# EAGLE design antares-I (EAGLE 4.16)
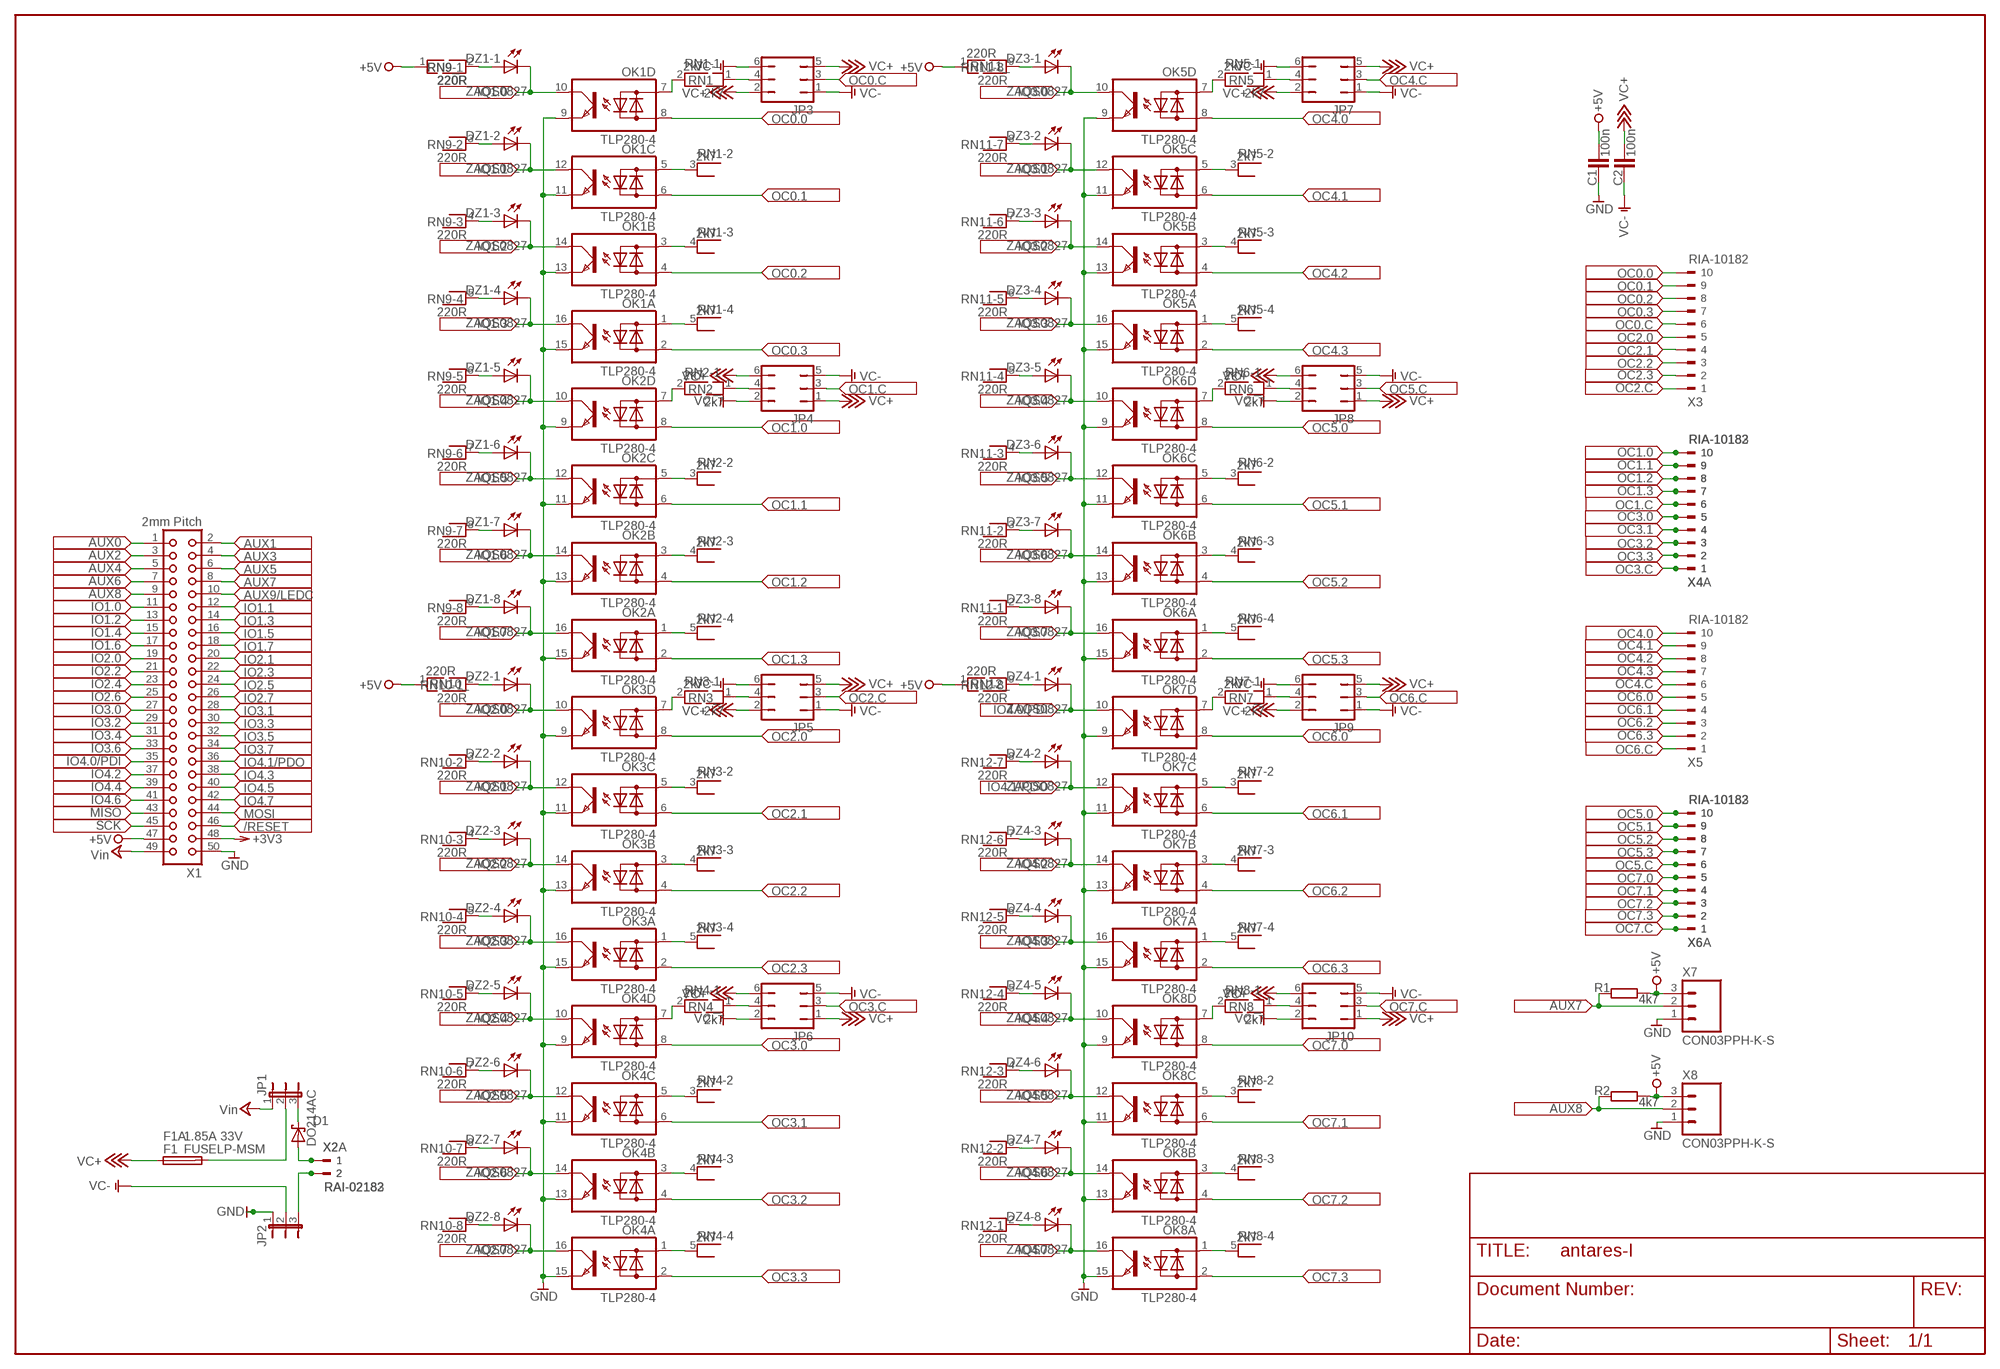
[diagram p0: schematic, sheet 1]

## Parts
C1  100n  C-EUC1206  [C1206]
C2  100n  C-EUC1206  [C1206]
D1  DO214AC  SCHOTTKY-DIODESMA  [SMA]
DZ1  ZAQS0827  [ZAQS0827]
DZ2  ZAQS0827  [ZAQS0827]
DZ3  ZAQS0827  [ZAQS0827]
DZ4  ZAQS0827  [ZAQS0827]
F1  FUSELP-MSM  [LP-MSM]
F1A  1.85A 33V  FUSEPOLY  [POLYFUSE]
JP1  JP2EI  [JP2]
JP2  JP2EI  [JP2]
JP3  JP3Q  [JP3Q]
JP4  JP3Q  [JP3Q]
JP5  JP3Q  [JP3Q]
JP6  JP3Q  [JP3Q]
JP7  JP3Q  [JP3Q]
JP8  JP3Q  [JP3Q]
JP9  JP3Q  [JP3Q]
JP10  JP3Q  [JP3Q]
OK1  TLP280-4  [MINI-FLAT-16]
OK2  TLP280-4  [MINI-FLAT-16]
OK3  TLP280-4  [MINI-FLAT-16]
OK4  TLP280-4  [MINI-FLAT-16]
OK5  TLP280-4  [MINI-FLAT-16]
OK6  TLP280-4  [MINI-FLAT-16]
OK7  TLP280-4  [MINI-FLAT-16]
OK8  TLP280-4  [MINI-FLAT-16]
R1  4k7  R-EU_R0603  [R0603]
R2  4k7  R-EU_R0603  [R0603]
RN1  2k7  RNX4  [RN-5]
RN2  2k7  RNX4  [RN-5]
RN3  2k7  RNX4  [RN-5]
RN4  2k7  RNX4  [RN-5]
RN5  2k7  RNX4  [RN-5]
RN6  2k7  RNX4  [RN-5]
RN7  2k7  RNX4  [RN-5]
RN8  2k7  RNX4  [RN-5]
RN9  220R  RNX8  [RN-9]
RN10  220R  RNX8  [RN-9]
RN11  220R  RNX8  [RN-9]
RN12  220R  RNX8  [RN-9]
X1  2mm Pitch  CON50M  [2MM-50DM]
X2  RAI-02183  [183-02]
X2A  RAI-02182  [182-02]
X3  RIA-10182  [182-10]
X4  RIA-10183  [183-10]
X4A  RIA-10182  [182-10]
X5  RIA-10182  [182-10]
X6  RIA-10183  [183-10]
X6A  RIA-10182  [182-10]
X7  CON03PPH-K-S  [B3B-PH-K-S]
X8  CON03PPH-K-S  [B3B-PH-K-S]

## Nets
+3V3: X1.48
+5V: C1.2 R1.2 R2.2 RN9.1 RN10.1 RN11.1 RN12.1 X1.47 X7.3 X8.3
/RESET: X1.46
AUX0: X1.1
AUX1: X1.2
AUX2: X1.3
AUX3: X1.4
AUX4: X1.5
AUX5: X1.6
AUX6: X1.7
AUX7: R1.1 X1.8 X7.2
AUX8: R2.1 X1.9 X8.2
AUX9: X1.10
GND [gnd-vcc]: C1.1 JP2.1 OK1.9(D:E) OK1.11(C:E) OK1.13(B:E) OK1.15(A:E) OK2.9(D:E) OK2.11(C:E) OK2.13(B:E) OK2.15(A:E) OK3.9(D:E) OK3.11(C:E) OK3.13(B:E) OK3.15(A:E) OK4.9(D:E) OK4.11(C:E) OK4.13(B:E) OK4.15(A:E) OK5.9(D:E) OK5.11(C:E) OK5.13(B:E) OK5.15(A:E) OK6.9(D:E) OK6.11(C:E) OK6.13(B:E) OK6.15(A:E) OK7.9(D:E) OK7.11(C:E) OK7.13(B:E) OK7.15(A:E) OK8.9(D:E) OK8.11(C:E) OK8.13(B:E) OK8.15(A:E) X1.50 X7.1 X8.1
IO1.0: DZ1.K1(-1:C) OK1.10(D:C) X1.11
IO1.1: DZ1.K2(-2:C) OK1.12(C:C) X1.12
IO1.2: DZ1.K3(-3:C) OK1.14(B:C) X1.13
IO1.3: DZ1.K4(-4:C) OK1.16(A:C) X1.14
IO1.4: DZ1.K5(-5:C) OK2.10(D:C) X1.15
IO1.5: DZ1.K6(-6:C) OK2.12(C:C) X1.16
IO1.6: DZ1.K7(-7:C) OK2.14(B:C) X1.17
IO1.7: DZ1.K8(-8:C) OK2.16(A:C) X1.18
IO2.0: DZ2.K1(-1:C) OK3.10(D:C) X1.19
IO2.1: DZ2.K2(-2:C) OK3.12(C:C) X1.20
IO2.2: DZ2.K3(-3:C) OK3.14(B:C) X1.21
IO2.3: DZ2.K4(-4:C) OK3.16(A:C) X1.22
IO2.4: DZ2.K5(-5:C) OK4.10(D:C) X1.23
IO2.5: DZ2.K6(-6:C) OK4.12(C:C) X1.24
IO2.6: DZ2.K7(-7:C) OK4.14(B:C) X1.25
IO2.7: DZ2.K8(-8:C) OK4.16(A:C) X1.26
IO3.0: DZ3.K1(-1:C) OK5.10(D:C) X1.27
IO3.1: DZ3.K2(-2:C) OK5.12(C:C) X1.28
IO3.2: DZ3.K3(-3:C) OK5.14(B:C) X1.29
IO3.3: DZ3.K4(-4:C) OK5.16(A:C) X1.30
IO3.4: DZ3.K5(-5:C) OK6.10(D:C) X1.31
IO3.5: DZ3.K6(-6:C) OK6.12(C:C) X1.32
IO3.6: DZ3.K7(-7:C) OK6.14(B:C) X1.33
IO3.7: DZ3.K8(-8:C) OK6.16(A:C) X1.34
IO4.0: DZ4.K1(-1:C) OK7.10(D:C) X1.35
IO4.1: DZ4.K2(-2:C) OK7.12(C:C) X1.36
IO4.2: DZ4.K3(-3:C) OK7.14(B:C) X1.37
IO4.3: DZ4.K4(-4:C) OK7.16(A:C) X1.38
IO4.4: DZ4.K5(-5:C) OK8.10(D:C) X1.39
IO4.5: DZ4.K6(-6:C) OK8.12(C:C) X1.40
IO4.6: DZ4.K7(-7:C) OK8.14(B:C) X1.41
IO4.7: DZ4.K8(-8:C) OK8.16(A:C) X1.42
MISO: X1.43
MOSI: X1.44
N$1 [power]: D1.A X2.1 X2A.1
N$2: D1.C JP1.3
N$3: OK2.7(D:AC1) RN2.2
N$4: OK5.7(D:AC1) RN5.2
N$5: OK5.5(C:AC1) RN5.3
N$6: OK2.5(C:AC1) RN2.3
N$7: OK1.7(D:AC1) RN1.2
N$8: OK2.1(A:AC1) RN2.5
N$9: OK2.3(B:AC1) RN2.4
N$10: OK3.7(D:AC1) RN3.2
N$11: OK3.5(C:AC1) RN3.3
N$12: OK3.3(B:AC1) RN3.4
N$13: OK3.1(A:AC1) RN3.5
N$14: OK4.7(D:AC1) RN4.2
N$15: OK4.5(C:AC1) RN4.3
N$16: OK4.3(B:AC1) RN4.4
N$17: OK4.1(A:AC1) RN4.5
N$18: OK5.3(B:AC1) RN5.4
N$19: OK5.1(A:AC1) RN5.5
N$20: OK6.7(D:AC1) RN6.2
N$21: OK6.5(C:AC1) RN6.3
N$22: OK6.3(B:AC1) RN6.4
N$23: OK6.1(A:AC1) RN6.5
N$24: OK7.7(D:AC1) RN7.2
N$25: OK7.5(C:AC1) RN7.3
N$26: OK7.3(B:AC1) RN7.4
N$27: OK7.1(A:AC1) RN7.5
N$28: OK8.7(D:AC1) RN8.2
N$29: OK8.5(C:AC1) RN8.3
N$30: OK8.3(B:AC1) RN8.4
N$31: OK8.1(A:AC1) RN8.5
N$32: JP3.4 RN1.1
N$33: JP4.4 RN2.1
N$34: JP5.4 RN3.1
N$35: JP6.4 RN4.1
N$36: JP7.4 RN5.1
N$37: JP10.4 RN8.1
N$38: JP9.4 RN7.1
N$39: JP8.4 RN6.1
N$40: JP2.3 X2.2 X2A.2
N$43: DZ1.A1(-1:A) RN9.2
N$44: DZ1.A2(-2:A) RN9.3
N$45: DZ1.A3(-3:A) RN9.4
N$46: DZ1.A4(-4:A) RN9.5
N$47: DZ1.A5(-5:A) RN9.6
N$48: DZ1.A6(-6:A) RN9.7
N$49: DZ1.A7(-7:A) RN9.8
N$50: DZ1.A8(-8:A) RN9.9
N$51: DZ2.A1(-1:A) RN10.2
N$52: DZ2.A2(-2:A) RN10.3
N$53: DZ2.A3(-3:A) RN10.4
N$54: DZ2.A4(-4:A) RN10.5
N$55: DZ2.A5(-5:A) RN10.6
N$56: DZ2.A6(-6:A) RN10.7
N$57: DZ2.A8(-8:A) RN10.9
N$58: DZ2.A7(-7:A) RN10.8
N$59: DZ3.A1(-1:A) RN11.9
N$60: DZ3.A2(-2:A) RN11.8
N$61: DZ3.A3(-3:A) RN11.7
N$62: DZ3.A4(-4:A) RN11.6
N$63: DZ3.A5(-5:A) RN11.5
N$64: DZ3.A6(-6:A) RN11.4
N$65: DZ3.A7(-7:A) RN11.3
N$66: DZ3.A8(-8:A) RN11.2
N$67: DZ4.A1(-1:A) RN12.9
N$68: DZ4.A2(-2:A) RN12.8
N$69: DZ4.A3(-3:A) RN12.7
N$70: DZ4.A4(-4:A) RN12.6
N$71: DZ4.A5(-5:A) RN12.5
N$72: DZ4.A6(-6:A) RN12.4
N$73: DZ4.A7(-7:A) RN12.3
N$74: DZ4.A8(-8:A) RN12.2
N$75: OK1.5(C:AC1) RN1.3
N$76: OK1.3(B:AC1) RN1.4
N$77: OK1.1(A:AC1) RN1.5
OC0.0: OK1.8(D:AC2) X3.10
OC0.1: OK1.6(C:AC2) X3.9
OC0.2: OK1.4(B:AC2) X3.8
OC0.3: OK1.2(A:AC2) X3.7
OC0.C: JP3.3 X3.6
OC1.0: OK2.8(D:AC2) X4.10 X4A.10
OC1.1: OK2.6(C:AC2) X4.9 X4A.9
OC1.2: OK2.4(B:AC2) X4.8 X4A.8
OC1.3: OK2.2(A:AC2) X4.7 X4A.7
OC1.C: JP4.3 X4.6 X4A.6
OC2.0: OK3.8(D:AC2) X3.5
OC2.1: OK3.6(C:AC2) X3.4
OC2.2: OK3.4(B:AC2) X3.3
OC2.3: OK3.2(A:AC2) X3.2
OC2.C: JP5.3 X3.1
OC3.0: OK4.8(D:AC2) X4.5 X4A.5
OC3.1: OK4.6(C:AC2) X4.4 X4A.4
OC3.2: OK4.4(B:AC2) X4.3 X4A.3
OC3.3: OK4.2(A:AC2) X4.2 X4A.2
OC3.C: JP6.3 X4.1 X4A.1
OC4.0: OK5.8(D:AC2) X5.10
OC4.1: OK5.6(C:AC2) X5.9
OC4.2: OK5.4(B:AC2) X5.8
OC4.3: OK5.2(A:AC2) X5.7
OC4.C: JP7.3 X5.6
OC5.0: OK6.8(D:AC2) X6.10 X6A.10
OC5.1: OK6.6(C:AC2) X6.9 X6A.9
OC5.2: OK6.4(B:AC2) X6.8 X6A.8
OC5.3: OK6.2(A:AC2) X6.7 X6A.7
OC5.C: JP8.3 X6.6 X6A.6
OC6.0: OK7.8(D:AC2) X5.5
OC6.1: OK7.6(C:AC2) X5.4
OC6.2: OK7.4(B:AC2) X5.3
OC6.3: OK7.2(A:AC2) X5.2
OC6.C: JP9.3 X5.1
OC7.0: OK8.8(D:AC2) X6.5 X6A.5
OC7.1: OK8.6(C:AC2) X6.4 X6A.4
OC7.2: OK8.4(B:AC2) X6.3 X6A.3
OC7.3: OK8.2(A:AC2) X6.2 X6A.2
OC7.C: JP10.3 X6.1 X6A.1
SCK: X1.45
VC+ [gnd-vcc]: C2.2 F1.1 F1A.1 JP3.2 JP3.5 JP4.1 JP4.6 JP5.2 JP5.5 JP6.1 JP6.6 JP7.2 JP7.5 JP8.1 JP8.6 JP9.2 JP9.5 JP10.1 JP10.6
VC- [gnd-vcc]: C2.1 JP2.2 JP3.1 JP3.6 JP4.2 JP4.5 JP5.1 JP5.6 JP6.2 JP6.5 JP7.1 JP7.6 JP8.2 JP8.5 JP9.1 JP9.6 JP10.2 JP10.5
VIN [power]: JP1.1 X1.49 ; supply symbol labelled Vin
VSUPP [power]: F1.2 F1A.2 JP1.2

## Library data of the parts
C1 C2 = rcl:C-EU: CAPACITOR, European symbol
D1 = diode:SCHOTTKY-DIODE: Schottky Diode
DZ1-DZ4 = led:ZAQS0827: LED BLOCK 9 LEDs, Siemens
F1 F1A = fuse:FUSE: Fuse
JP1 JP2 = jumper:JP2E: JUMPER
JP3-JP10 = jumper:JP3Q: JUMPER
OK1-OK8 = optocoupler:TLP280-4: TEXAS INSTRUMENTS OPTO COUPLER
R1 R2 = rcl:R-EU_: RESISTOR, European symbol
RN1-RN8 = resistor-net:RNX4: RESISTOR NETWORK
RN9-RN12 = resistor-net:RNX8: RESISTOR NETWORK
X1 = con-2mm-dual:CON50: CONNECTOR
X2 X2A = con-ria:RAI-02
X3 X4 X4A X5 X6 X6A = con-ria:RIA-10
X7 X8 = _frank:CON03P

## Net classes
0 default: width 0.15 mm, drill 0.15 mm, clearance 0.3 mm
1 power: width 0.15 mm, drill 0.3 mm, clearance 0.3 mm
2 gnd-vcc: width 0.3 mm, drill 0.15 mm, clearance 0.3 mm

## Board
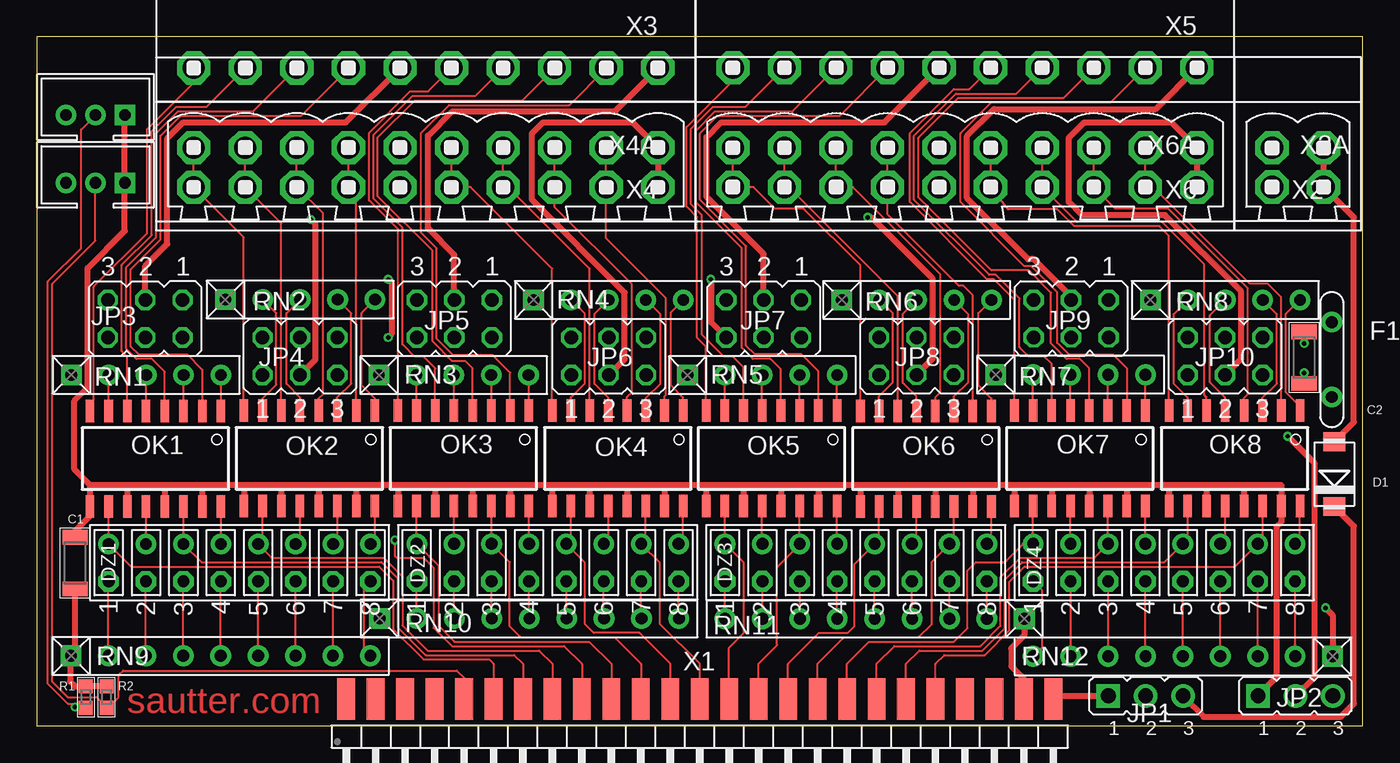
[diagram p1: board, top side]
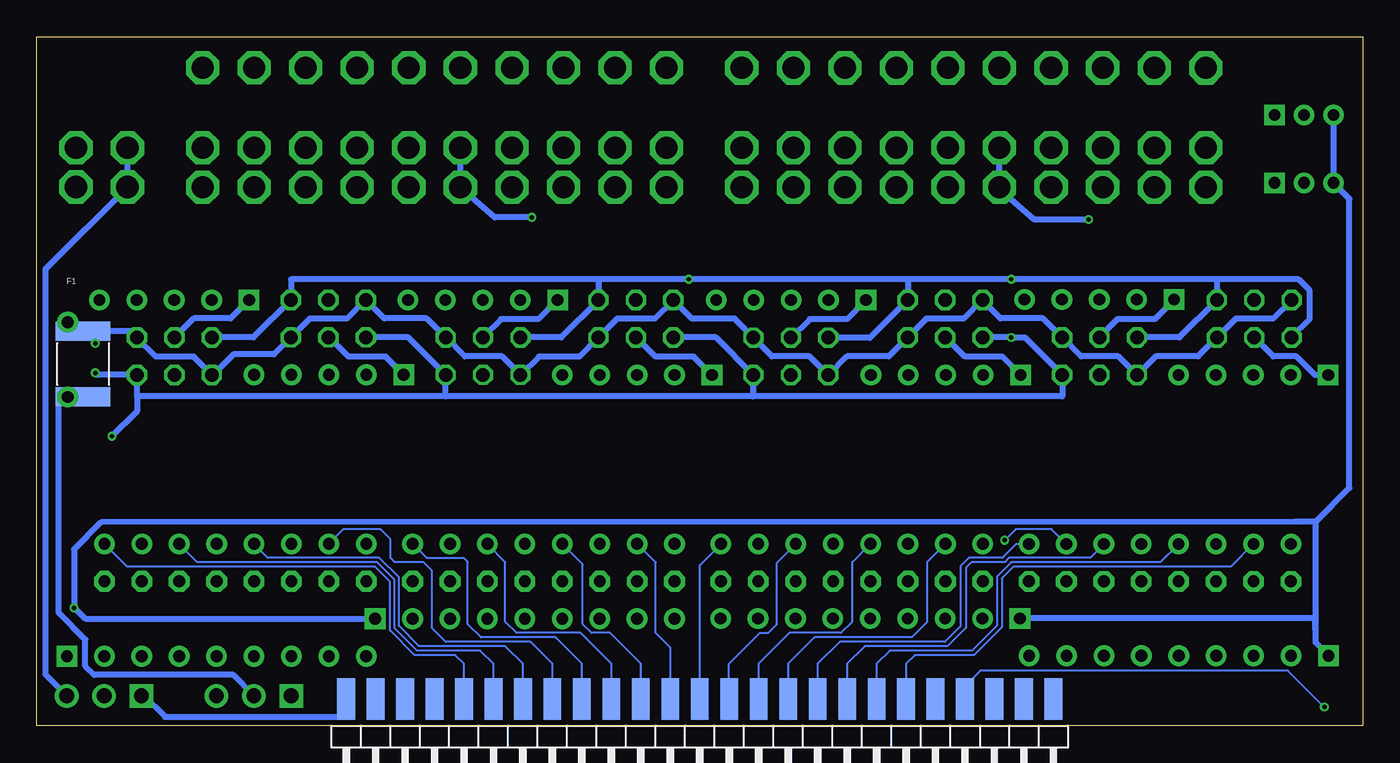
[diagram p2: board, bottom side, seen from below]

Size 90 x 46.75 mm. Coordinates in mm from the lower left corner, seen from the top.
Outline: 90,0 90,46.75 0,46.75 0,0 90,0
Copper layers (1*16): Top 0.035mm / dielectric 1.5mm / Bottom 0.035mm
Design rules "default": minimum track width 0.15mm, minimum drill 0.3mm, track to track 0.15mm, track to pad 0.15mm, pad to pad 0.15mm, via to via 0.15mm, smd to smd 0mil, copper to edge 0.35mm, drill to drill 8mil, minimum pad ring 0.15mm, minimum via ring 0.15mm, stop-mask expansion 0.15mm, vias tented up to drill 0.35mm, thermal gap 10mil

### Footprints (pad centres in the part's own frame; a part is rotated, then mirrored left to right if it is on the bottom)
C1206 = smd 1 x 1.7: 1 -1.75,0; 2 1.75,0
SMA = smd 1.27 x 1.473: A 2.2,0; C -2.2,0
ZAQS0827 = drill 0.8 pad 1.4 octagon: A1 -1.27,8.89; A2 -1.27,6.35; A3 -1.27,3.81; A4 -1.27,1.27; A5 -1.27,-1.27; A6 -1.27,-3.81; A7 -1.27,-6.35; A8 -1.27,-8.89 | drill 0.8 pad 1.4 round: K1 1.27,8.89; K2 1.27,6.35; K3 1.27,3.81; K4 1.27,1.27; K5 1.27,-1.27; K6 1.27,-3.81; K7 1.27,-6.35; K8 1.27,-8.89
LP-MSM = smd 1.27 x 3.683: 1 -2.222,0; 2 2.223,0
POLYFUSE = drill 0.8 pad 1.4 round: 1 -2.54,0; 2 2.54,0
JP2 = drill 1 pad 1.6 square: 1 -2.54,0 | drill 1 pad 1.6 round: 2 0,0; 3 2.54,0
JP3Q = drill 0.914 octagon: 1 -2.54,-1.27; 2 -2.54,1.27; 3 0,-1.27; 4 0,1.27; 5 2.54,-1.27; 6 2.54,1.27
MINI-FLAT-16 = smd 1.524 x 0.584: 1 -3.24,4.445; 2 -3.24,3.175; 3 -3.24,1.905; 4 -3.24,0.635; 5 -3.24,-0.635; 6 -3.24,-1.905; 7 -3.24,-3.175; 8 -3.24,-4.445; 9 3.24,-4.445; 10 3.24,-3.175; 11 3.24,-1.905; 12 3.24,-0.635; 13 3.24,0.635; 14 3.24,1.905; 15 3.24,3.175; 16 3.24,4.445
R0603 = smd 0.95 x 0.95: 1 -0.725,0; 2 0.725,0
RN-5 = drill 0.8 pad 1.4 square: 1 -5.08,0 | drill 0.8 pad 1.4 round: 2 -2.54,0; 3 0,0; 4 2.54,0; 5 5.08,0
RN-9 = drill 0.8 pad 1.4 square: 1 -10.16,0 | drill 0.8 pad 1.4 round: 2 -7.62,0; 3 -5.08,0; 4 -2.54,0; 5 0,0; 6 2.54,0; 7 5.08,0; 8 7.62,0; 9 10.16,0
2MM-50DM = smd 2.8 x 1.2: 1 3.3,24; 3 3.3,22; 5 3.3,20; 7 3.3,18; 9 3.3,16; 11 3.3,14; 13 3.3,12; 15 3.3,10; 17 3.3,8; 19 3.3,6; 21 3.3,4; 23 3.3,2; 25 3.3,0; 27 3.3,-2; 29 3.3,-4; 31 3.3,-6; 33 3.3,-8; 35 3.3,-10; 37 3.3,-12; 39 3.3,-14; 41 3.3,-16; 43 3.3,-18; 45 3.3,-20; 47 3.3,-22; 49 3.3,-24 | smd 2.8 x 1.2 bottom: 2 3.3,24; 4 3.3,22; 6 3.3,20; 8 3.3,18; 10 3.3,16; 12 3.3,14; 14 3.3,12; 16 3.3,10; 18 3.3,8; 20 3.3,6; 22 3.3,4; 24 3.3,2; 26 3.3,0; 28 3.3,-2; 30 3.3,-4; 32 3.3,-6; 34 3.3,-8; 36 3.3,-10; 38 3.3,-12; 40 3.3,-14; 42 3.3,-16; 44 3.3,-18; 46 3.3,-20; 48 3.3,-22; 50 3.3,-24
183-02 = drill 1.5 pad 2 octagon: 1 -1.75,0; 2 1.75,0
182-02 = drill 1.5 pad 2 octagon: 1 -1.75,0; 2 1.75,0
182-10 = drill 1.5 pad 2 octagon: 1 -15.75,0; 2 -12.25,0; 3 -8.75,0; 4 -5.25,0; 5 -1.75,0; 6 1.75,0; 7 5.25,0; 8 8.75,0; 9 12.25,0; 10 15.75,0
183-10 = drill 1.5 pad 2 octagon: 1 -15.75,0; 2 -12.25,0; 3 -8.75,0; 4 -5.25,0; 5 -1.75,0; 6 1.75,0; 7 5.25,0; 8 8.75,0; 9 12.25,0; 10 15.75,0
B3B-PH-K-S = drill 0.8 pad 1.4 square: 1 0,-2 | drill 0.8 pad 1.4 round: 2 0,0; 3 0,2

### Placement (x,y rotation side)
C1  2.6,11.04 270 top
C2  86.02,24.98 90 top
D1  88.08,17.08 90 top
DZ1  13.76,11.07 90 top
DZ2  34.67,11.07 90 top
DZ3  55.6,11.07 90 top
DZ4  76.53,11.07 90 top
F1  86.86,24.55 270 bottom
F1A  87.91,24.85 270 top
JP1  75.27,2.04 0 top
JP2  85.43,2.04 0 top
JP3  7.36,27.62 180 top
JP4  17.86,25.08 0 top
JP5  28.34,27.62 180 top
JP6  38.81,25.07 0 top
JP7  49.34,27.62 180 top
JP8  59.71,25.09 0 top
JP9  70.21,27.63 180 top
JP10  80.67,25.07 0 top
OK1  8.05,18.14 270 top
OK2  18.5,18.14 270 top
OK3  28.95,18.14 270 top
OK4  39.43,18.15 270 top
OK5  49.88,18.15 270 top
OK6  60.35,18.12 270 top
OK7  70.8,18.15 270 top
OK8  81.3,18.15 270 top
R1  3.33,1.95 90 top
R2  4.73,1.95 90 top
RN1  7.42,23.81 0 top
RN2  17.88,28.93 0 top
RN3  28.3,23.8 0 top
RN4  38.8,28.9 0 top
RN5  49.25,23.8 0 top
RN6  59.73,28.9 0 top
RN7  70.17,23.82 0 top
RN8  80.67,28.9 0 top
RN9  12.48,4.75 0 top
RN10  33.42,7.29 0 top
RN11  56.88,7.26 180 top
RN12  77.8,4.71 180 top
X1  45,-1.49 90 top
X2  85.59,39.22 180 top
X2A  85.59,36.56 180 top
X3  26.4,44.64 180 top
X4  26.4,39.23 180 top
X4A  26.4,36.54 180 top
X5  63,44.65 180 top
X6  63,39.23 180 top
X6A  63,36.55 180 top
X7  3.98,41.44 90 top
X8  3.98,36.84 90 top

### Tracks (layer width: path | path; a pad name or v marks a point on that pad's centre or on a via)
+5V  (via drill 0.3 pad 0.6)
  Top 0.4: X1.47 67,3.2 66.15,4.05 66.15,5.25 67.05,6.15 67.05,7.2 67.03,7.21 RN11.1 | RN12.1 87.96,7.51 v87.47,8 | C1.2 2.6,5.08 2.3,4.78 RN9.1 | 3.31,2.7 3.3,2.7 | 3.31,2.7 R1.2 2.59,2.68 2.25,3 2.25,4.75 RN9.1 | R2.2 4.71,2.7 3.31,2.7 | RN9.1
  Bottom 0.4: RN9.1 3.2,5.65 | 3.2,13.85 4.6,13.85 85.65,13.8 87.47,11.97 v87.47,8 86.71,7.26 RN11.1 | 3.2,5.65 3.2,13.85 | RN10.1 3.21,7.29 3.2,5.65 | X7.3 X8.3 0.9,35.76 0.9,16.15 3.2,13.85
AUX7  (via drill 0.3 pad 0.6)
  Top 0.15: X7.2 3,40.46 3,32.4 0.75,30.15 0.75,2.85 2.1,1.5 2.83,1.5 | R1.1 3.3,1.25 3.3,1.5 2.83,1.5 | 2.83,1.5 v2.6,1.27
  Bottom 0.15: X1.8 27,2.7 25.95,3.75 5.08,3.75 v2.6,1.27
AUX8
  Top 0.15: X8.2 3.98,32.93 1.05,30 1.05,3 2.1,1.95 4.05,1.95 4.65,1.35 4.65,1.3 R2.1 4.83,1.23 5.55,1.95 5.55,3.45 5.85,3.75 28.5,3.75 29,3.25 X1.9
GND
  Top 0.4: 3.61,16.35 OK1.9 3.61,14.26 2.59,13.24 C1.1 | 3.61,16.35 6.15,16.35 | 6.15,16.35 8.7,16.35 | 8.7,16.35 11.22,16.35 | 11.22,16.35 14.05,16.35 | 14.05,16.35 16.6,16.35 | 16.6,16.35 19.12,16.35 | 19.12,16.35 21.68,16.35 | 21.68,16.35 24.52,16.35 | 24.52,16.35 27.05,16.35 | 27.05,16.35 29.6,16.35 | 29.6,16.35 32.12,16.35 | 32.12,16.35 34.98,16.35 | 34.98,16.35 37.52,16.35 | 37.52,16.35 40.08,16.35 | 40.08,16.35 42.6,16.35 | 42.6,16.35 45.42,16.35 | 45.42,16.35 47.98,16.35 | 47.98,16.35 50.5,16.35 | 50.5,16.35 53.05,16.35 | 53.05,16.35 55.9,16.35 | 55.9,16.35 58.45,16.35 | 58.45,16.35 60.98,16.35 | 60.98,16.35 63.52,16.35 | 63.52,16.35 66.35,16.35 | 66.35,16.35 68.9,16.35 | 68.9,16.35 71.45,16.35 | 71.45,16.35 73.97,16.35 | 73.97,16.35 76.85,16.35 | 76.85,16.35 79.4,16.35 | 79.4,16.35 81.92,16.35 | OK8.13 81.94,16.05 81.92,16.35 | OK8.11 79.39,16.05 79.4,16.35 | OK8.9 76.86,16.05 76.85,16.35 | 73.97,16.35 OK7.15 | OK7.13 71.44,16.05 71.45,16.35 | OK7.11 68.89,16.05 68.9,16.35 | OK7.9 66.36,16.05 66.35,16.35 | 63.52,16.35 OK6.15 | OK6.13 60.98,16.05 60.98,16.35 | OK6.11 58.45,16.05 58.45,16.35 | OK6.9 55.91,16.05 55.9,16.35 | 53.05,16.35 OK5.15 | OK5.13 50.51,16.05 50.5,16.35 | OK5.11 47.97,16.05 47.98,16.35 | OK5.9 45.43,16.05 45.42,16.35 | OK4.15 42.6,16.05 42.6,16.35 | OK4.13 40.06,16.05 40.08,16.35 | 37.52,16.35 OK4.11 | OK4.9 34.98,16.05 34.98,16.35 | OK3.15 32.13,16.05 32.12,16.35 | OK3.13 29.59,16.05 29.6,16.35 | 27.05,16.35 OK3.11 | OK3.9 24.51,16.05 24.52,16.35 | OK2.15 21.68,16.05 21.68,16.35 | OK2.13 19.14,16.05 19.12,16.35 | 16.6,16.35 OK2.11 | OK2.9 14.06,16.05 14.05,16.35 | OK1.15 11.23,16.05 11.22,16.35 | OK1.13 8.69,16.05 8.7,16.35 | 6.15,16.35 OK1.11
  Top 0.4: 81.92,16.35 84.47,16.35 OK8.15 84.47,13.82 84.15,13.5 84.15,3.29 JP2.1 | X7.1 5.98,36.85 X8.1 5.98,33.58 3.45,31.05 3.45,22.95 2.55,22.05 2.55,17.4 3.6,16.35 3.61,16.35
  Bottom 0.4: X1.50 69,0.6 81.3,0.6 82.8,2.1 82.83,2.1 JP2.1
IO1.0
  Top 0.15: OK1.10 4.88,12.36 DZ1.K1 6.4,10.8 23.25,10.8 24.2,9.85 24.2,6.55 26.25,4.5 30.7,4.5 31,4.2 X1.11
IO1.1
  Top 0.15: DZ1.K2 7.42,12.35 7.42,12.36 OK1.12
  Bottom 0.15: X1.12 31,4.2 30.4,4.8 26.4,4.8 24.5,6.7 24.5,10 23.7,10.8 8.95,10.8 DZ1.K2
IO1.2
  Top 0.15: OK1.14 9.96,12.36 DZ1.K3 9.95,12.32 11.18,11.1 23.4,11.1 24.5,10 24.5,6.7 26.4,4.8 32.4,4.8 33,4.2 X1.13
IO1.3
  Top 0.15: DZ1.K4 OK1.16
  Bottom 0.15: X1.14 33,4.2 32.1,5.1 26.52,5.1 24.82,6.8 24.82,10.12 23.85,11.1 13.72,11.1 DZ1.K4
IO1.4
  Top 0.15: OK2.10 15.33,12.63 DZ1.K5 15.03,12.32 15.95,11.4 23.55,11.4 24.82,10.12 24.82,6.8 26.52,5.1 34.1,5.1 35,4.2 X1.15
IO1.5
  Top 0.15: DZ1.K6 17.87,12.64 OK2.12
  Bottom 0.15: X1.16 35,4.2 33.8,5.4 28.18,5.4 26.93,6.65 26.93,10.72 26.55,11.1 24.3,11.1 24,11.4 18.5,11.4 17.57,12.32 DZ1.K6
IO1.6  (via drill 0.3 pad 0.6)
  Top 0.15: DZ1.K7 20.41,12.63 OK2.14 | X1.17 37,4.2 35.8,5.4 28.18,5.4 26.93,6.65 26.93,10.72 26.25,11.4 24.45,11.4 24.3,11.55 v24.3,12.6
  Bottom 0.15: DZ1.K7 21.12,13.35 23.55,13.35 v24.3,12.6
IO1.7
  Top 0.15: DZ1.K8 22.95,12.65 OK2.16
  Bottom 0.15: X1.18 37,4.2 35.5,5.7 28.35,5.7 27.3,6.75 27.3,10.82 26.73,11.4 24.45,11.4 23.52,12.32 22.65,12.32 DZ1.K8
IO2.0
  Top 0.15: OK3.10 25.78,12.36 DZ2.K1 27.3,10.82 27.3,6.75 28.35,5.7 37.5,5.7 39,4.2 X1.19
IO2.1
  Top 0.15: DZ2.K2 28.32,12.36 OK3.12
  Bottom 0.15: X1.20 39,4.2 37.2,6 30.6,6 29.55,7.05 29.55,11.12 DZ2.K2
IO2.2
  Top 0.15: OK3.14 30.86,12.37 30.88,12.35 DZ2.K3 32.1,11.1 32.1,6.75 32.85,6 39.2,6 41,4.2 X1.21
IO2.3
  Top 0.15: DZ2.K4 OK3.16
  Bottom 0.15: X1.22 41,4.2 38.9,6.3 35.4,6.3 34.65,7.05 34.65,11.1 DZ2.K4
IO2.4
  Top 0.15: OK4.10 36.26,12.65 DZ2.K5 37.2,11.07 37.2,6.9 37.8,6.3 40.9,6.3 43,4.2 X1.23
IO2.5
  Top 0.15: DZ2.K6 38.49,12.35 38.8,12.64 OK4.12
  Bottom 0.15: X1.24 43,4.2 40.9,6.3 40.35,6.3 39.75,6.9 39.75,11.07 DZ2.K6
IO2.6
  Top 0.15: OK4.14 41.34,12.63 41.02,12.32 | X1.25 45,4.2 42.3,6.9 42.3,11.05 41.02,12.32 | 41.02,12.32 DZ2.K7
IO2.7
  Top 0.15: DZ2.K8 43.88,12.65 OK4.16
  Bottom 0.15: DZ2.K8 45,10.9 X1.26
IO3.0
  Top 0.15: OK5.10 46.7,12.32 DZ3.K1 48,11.05 48,6.3 47,5.3 X1.27
IO3.1
  Top 0.15: DZ3.K2 49.24,12.36 OK5.12
  Bottom 0.15: X1.28 47,5.3 48,6.3 48,11.1 DZ3.K2
IO3.2
  Top 0.15: OK5.14 51.78,12.37 DZ3.K3 51.8,12.32 50.25,10.78 50.25,5.47 49,4.22 X1.29
IO3.3
  Top 0.15: OK5.16 54.32,12.36 DZ3.K4
  Bottom 0.15: X1.30 49,4.22 51.08,6.3 52.35,6.3 52.95,6.9 52.95,10.95 DZ3.K4
IO3.4
  Top 0.15: OK6.10 57.17,12.65 DZ3.K5 56.87,12.32 55.5,10.95 55.5,6.75 55.05,6.3 53.1,6.3 51,4.2 X1.31
IO3.5
  Top 0.15: DZ3.K6 59.72,12.64 OK6.12
  Bottom 0.15: X1.32 51,4.2 53.1,6.3 57.45,6.3 58.2,7.05 58.2,11.1 59.41,12.31 DZ3.K6
IO3.6
  Top 0.15: OK6.14 62.26,12.65 DZ3.K7 61.95,12.32 60.75,11.12 60.75,6.9 59.85,6 54.8,6 53,4.2 X1.33
IO3.7
  Top 0.15: DZ3.K8 64.8,12.64 OK6.16
  Bottom 0.15: X1.34 53,4.2 54.8,6 59.85,6 60.75,6.9 60.75,11.12 61,11.38 63.52,11.38 DZ3.K8
IO4.0
  Top 0.15: OK7.10 67.62,12.35 DZ4.K1 67.62,12.35 67.6,12.32 66.92,12.32 65.7,11.1 63.75,11.1 63.17,10.53 63.17,6.62 62.25,5.7 56.5,5.7 55,4.2 X1.35
IO4.1
  Top 0.15: DZ4.K2 70.17,12.36 OK7.12
  Bottom 0.15: X1.36 55,4.2 56.5,5.7 62.25,5.7 63.17,6.62 63.17,10.53 63.75,11.1 65.7,11.1 66,11.4 66,12.65 66.67,13.32 69.2,13.32 DZ4.K2
IO4.2
  Top 0.15: OK7.14 72.7,12.37 DZ4.K3 71.78,11.4 66.75,11.4 65.42,10.07 65.42,6.78 64.05,5.4 58.2,5.4 57,4.2 X1.37
IO4.3
  Top 0.15: OK7.16 75.25,12.36 DZ4.K4
  Bottom 0.15: X1.38 57,4.2 58.2,5.4 64.05,5.4 65.42,6.78 65.42,10.07 66.75,11.4 74.33,11.4 DZ4.K4
IO4.4
  Top 0.15: OK8.10 78.12,12.65 77.8,12.32 DZ4.K5 76.55,11.1 66.9,11.1 65.72,9.93 65.72,6.62 64.2,5.1 59.9,5.1 59,4.2 X1.39
IO4.5
  Top 0.15: DZ4.K6 80.67,12.66 OK8.12
  Bottom 0.15: X1.40 59,4.2 59.9,5.1 64.2,5.1 65.72,6.62 65.72,9.93 66.9,11.1 79.1,11.1 DZ4.K6
IO4.6
  Top 0.15: OK8.14 83.2,12.68 DZ4.K7 81.33,10.8 67.05,10.8 66.03,9.78 66.03,6.47 64.35,4.8 61.6,4.8 61,4.2 X1.41
IO4.7
  Top 0.15: DZ4.K8 85.75,12.67 OK8.16
  Bottom 0.15: X1.42 61,4.2 61.6,4.8 64.35,4.8 66.03,6.47 66.03,9.78 67.05,10.8 83.88,10.8 DZ4.K8
N$1
  Top 0.4: D1.A 89.4,20.61 89.4,34.51 X2A.1 X2.1
N$2
  Top 0.4: D1.C 89.4,13.55 89.4,1.5 88.5,0.6 79.2,0.6 77.85,1.95 77.85,2 JP1.3
N$3
  Top 0.15: RN2.2 16.25,28.01 16.25,23.15 15.3,22.2 15.3,21.35 OK2.7
N$4
  Top 0.15: RN5.2 46.71,23.82 46.7,23.82 OK5.7
N$5
  Top 0.15: OK5.5 RN5.3
N$6
  Top 0.15: RN2.3 16.95,28 16.95,23.2 17.88,22.27 OK2.5
N$7
  Top 0.15: RN1.2 4.88,23.8 OK1.7
N$8
  Top 0.15: RN2.5 22.05,28.02 22.05,23.1 22.95,22.2 OK2.1 22.95,21.3
N$9
  Top 0.15: RN2.4 21.35,27.98 21.35,23.23 20.4,22.3 OK2.3
N$10
  Top 0.15: RN3.2 25.78,23.77 OK3.7
N$11
  Top 0.15: OK3.5 28.32,23.78 RN3.3
N$12
  Top 0.15: RN3.4 30.82,23.8 30.86,23.77 OK3.3
N$13
  Top 0.15: RN3.5 33.4,23.77 OK3.1
N$14
  Top 0.15: RN4.2 37.2,27.96 37.2,23.25 36.25,22.3 OK4.7 | OK4.7 36.25,21.38 | OK4.7
N$15
  Top 0.15: RN4.3 37.85,27.95 37.85,23.2 38.8,22.25 OK4.5
N$16
  Top 0.15: RN4.4 42.33,27.93 42.33,23.23 41.35,22.25 OK4.3
N$17
  Top 0.15: RN4.5 43.05,28.07 43.05,23.1 43.88,22.27 OK4.1 43.88,21.38
N$18
  Top 0.15: RN5.4 51.77,23.8 RN5.4 OK5.3
N$19
  Top 0.15: RN5.5 54.33,23.63 54.3,23.6 54.32,23.58 OK5.1
N$20
  Top 0.15: RN6.2 58.1,27.98 58.1,23.3 57.17,22.38 OK6.7
N$21
  Top 0.15: RN6.3 58.77,27.95 58.77,23.27 59.7,22.35 59.7,21.38 OK6.5
N$22
  Top 0.15: RN6.4 63.23,27.93 63.23,23.32 62.25,22.35 OK6.3
N$23
  Top 0.15: RN6.5 63.9,28 63.9,23.1 64.8,22.2 OK6.1
N$24
  Top 0.15: RN7.2 OK7.7
N$25
  Top 0.15: OK7.5 RN7.3
N$26
  Top 0.15: RN7.4 72.7,23.8 OK7.3
N$27
  Top 0.15: RN7.5 OK7.1
N$28
  Top 0.15: RN8.2 77.17,27.94 77.17,23.23 78.12,22.27 OK8.7
N$29
  Top 0.15: RN8.3 79.62,27.85 79.62,23.3 80.67,22.27 80.67,21.4 OK8.5
N$30
  Top 0.15: RN8.4 84.17,27.93 84.17,23.23 83.2,22.27 OK8.3 | OK8.3 83.2,21.38 | OK8.3
N$31
  Top 0.15: RN8.5 84.8,27.95 84.8,22.63 85.72,21.7 OK8.1
N$32
  Bottom 0.4: RN1.1 3.23,23.8 4.5,25.07 6.08,25.07 JP3.4
N$33
  Bottom 0.4: RN2.1 14.12,27.6 16.65,27.6 17.85,26.4 17.85,26.36 JP4.4
N$34
  Bottom 0.4: RN3.1 24.47,25.05 27,25.05 28.35,26.4 JP5.4
N$35
  Bottom 0.4: RN4.1 35.02,27.6 37.52,27.6 38.8,26.32 JP6.4
N$36
  Bottom 0.4: RN5.1 45.42,25.05 48,25.05 49.35,26.4 49.35,26.36 JP7.4
N$37
  Bottom 0.4: RN8.1 76.84,27.65 79.35,27.65 80.65,26.35 JP10.4 | JP10.4 | JP10.4
N$38
  Bottom 0.4: RN7.1 66.32,25.05 68.85,25.05 70.2,26.4 JP9.4
N$39
  Bottom 0.4: RN6.1 55.95,27.6 58.5,27.6 59.7,26.4 JP8.4
N$40
  Bottom 0.4: JP2.3 89.4,3.46 89.4,31 X2A.2 83.84,39.15 83.85,39.15 83.84,39.16 X2.2
N$43
  Top 0.15: DZ1.A1 4.87,9.78 4.88,9.78 4.86,9.76 RN9.2
N$44
  Top 0.15: DZ1.A2 7.42,9.8 7.4,9.78 RN9.3
N$45
  Top 0.15: DZ1.A3 9.95,9.82 9.94,9.81 RN9.4
N$46
  Top 0.15: 12.49,9.81 12.5,9.82 | 12.49,9.81 DZ1.A4 | RN9.5 DZ1.A4 12.49,9.81
N$47
  Top 0.15: DZ1.A5 15.03,9.78 15.02,9.77 RN9.6
N$48
  Top 0.15: DZ1.A6 17.57,9.78 17.56,9.76 RN9.7
N$49
  Top 0.15: DZ1.A7 20.11,9.77 20.12,9.75 20.1,9.72 RN9.8
N$50
  Top 0.15: RN9.9 22.2,5.19 22.2,9.35 DZ1.A8
N$51
  Top 0.15: RN10.2 25.77,7.3 25.79,7.31 DZ2.A1
N$52
  Top 0.15: RN10.3 28.32,7.3 DZ2.A2
N$53
  Top 0.15: RN10.4 30.86,7.31 DZ2.A3
N$54
  Top 0.15: RN10.5 33.42,7.28 33.41,7.29 DZ2.A4
N$55
  Top 0.15: 35.98,7.28 RN10.6 35.95,7.3 DZ2.A5
N$56
  Top 0.15: RN10.7 38.5,7.28 38.48,7.29 DZ2.A6
N$57
  Top 0.15: RN10.9 43.6,7.28 | RN10.9 | DZ2.A8 43.56,7.31 RN10.9
N$58
  Top 0.15: RN10.8 41.05,7.28 | RN10.8 | DZ2.A7 41.02,7.3 RN10.8
N$59
  Top 0.15: DZ3.A1 46.73,9.8 DZ3.A1 RN11.9
N$60
  Top 0.15: RN11.8 DZ3.A2
N$61
  Top 0.15: RN11.7 51.8,7.28 51.79,7.29 DZ3.A3
N$62
  Top 0.15: RN11.6 54.33,7.28 DZ3.A4
N$63
  Top 0.15: RN11.5 56.88,7.33 56.87,7.33 DZ3.A5
N$64
  Top 0.15: RN11.4 59.42,7.28 59.41,7.29 DZ3.A6
N$65
  Top 0.15: RN11.3 61.95,7.28 DZ3.A7
N$66
  Top 0.15: RN11.2 64.5,7.28 64.49,7.29 DZ3.A8
N$67
  Top 0.15: DZ4.A1 68.25,9.19 68.25,5.33 RN12.9
N$68
  Top 0.15: DZ4.A2 70.19,9.8 70.2,9.8 70.18,9.78 RN12.8
N$69
  Top 0.15: DZ4.A3 RN12.7
N$70
  Top 0.15: DZ4.A4 RN12.6
N$71
  Top 0.15: DZ4.A5 77.8,9.82 RN12.5
N$72
  Top 0.15: DZ4.A6 80.33,9.8 80.34,9.79 RN12.4
N$73
  Top 0.15: DZ4.A7 82.88,9.82 RN12.3
N$74
  Top 0.15: DZ4.A8 RN12.2
N$75
  Top 0.15: RN1.3 7.42,23.8 OK1.5
N$76
  Top 0.15: RN1.4 9.97,23.8 9.96,23.79 OK1.3
N$77
  Top 0.15: OK1.1 RN1.5
OC0.0
  Top 0.15: OK1.8 3.58,21.43 3.58,21.88 3.88,22.18 3.88,29.82 7.49,33.44 7.49,40.48 10.65,43.65 X3.10
OC0.1
  Top 0.15: 6.15,21.3 OK1.6 6.15,25.05 5.78,25.43 5.78,31.27 7.8,33.3 7.8,40.35 9.45,42 11.53,42 14.15,44.62 X3.9
OC0.2
  Top 0.15: OK1.4 8.69,24.01 7.8,24.9 6.75,24.9 6.08,25.57 6.08,31.12 8.1,33.15 8.1,40.2 9.6,41.7 14.7,41.7 X3.8
OC0.3
  Top 0.15: OK1.2 11.23,24.17 10.2,25.2 6.9,25.2 6.38,25.73 6.38,30.98 8.4,33 8.4,40.05 9.75,41.4 17.93,41.4 21.15,44.62 X3.7
OC0.C
  Top 0.4: JP3.3 7.36,31.21 8.85,32.7 8.86,39.88 9.93,40.95 20.98,40.95 24.65,44.62 X3.6
OC1.0
  Top 0.15: X4.10 X4A.10 14.05,33.14 OK2.8
OC1.1
  Top 0.15: X4.9 X4A.9 16.6,34.09 OK2.6
OC1.2
  Top 0.15: OK2.4 19.14,22.21 19.43,22.5 19.43,34.77 X4A.8 X4.8
OC1.3
  Top 0.15: OK2.2 21.68,35.95 21.15,36.48 X4A.7 X4.7
OC1.C  (via drill 0.3 pad 0.6)
  Top 0.4: JP4.3 18.93,24.87 18.93,34.02 v18.6,34.35
  Bottom 0.4: v18.6,34.35 22.27,34.35 24.65,36.42 X4A.6 X4.6
OC2.0
  Top 0.15: OK3.8 24.51,33.69 22.55,35.65 22.55,40.23 25.35,43.05 26.57,43.05 28.15,44.62 X3.5
OC2.1
  Top 0.15: X3.4 31.65,44.62 29.77,42.75 25.5,42.75 22.85,40.1 22.85,35.77 24.82,33.8 24.82,25.88 25.65,25.05 26.25,25.05 27.05,24.25 OK3.6
OC2.2
  Top 0.15: OK3.4 29.59,24.26 29.1,24.75 28.2,24.75 26.85,26.1 26.85,32.23 23.15,35.92 23.15,39.92 25.65,42.42 32.95,42.42 35.15,44.62 X3.3
OC2.3
  Top 0.15: OK3.2 32.13,23.97 30.95,25.15 28.25,25.15 27.15,26.25 27.15,32.4 26.1,33.45 26.1,40.25 27.98,42.12 36.15,42.12 38.65,44.62 X3.2
OC2.C
  Top 0.4: JP5.3 28.34,31.96 26.55,33.75 26.55,40.05 28.2,41.7 39.25,41.7 42.17,44.62 X3.1
OC3.0
  Top 0.15: OK4.8 34.98,31.02 29.45,36.55 X4A.5 X4.5
OC3.1
  Top 0.15: OK4.6 37.52,31.02 32,36.55 X4A.4 X4.4
OC3.2
  Top 0.15: OK4.4 40.06,22.32 40.4,22.65 40.4,29.95 35.15,35.2 X4A.3 X4.3
OC3.3
  Top 0.15: OK4.2 42.6,22.36 42.7,22.45 42.7,29.02 38.65,33.08 X4A.2 X4.2
OC3.C
  Top 0.4: JP6.3 39.9,24.89 39.9,29.4 33.6,35.7 33.6,40.2 34.35,40.95 40.44,40.95 X4.1 X4A.1
OC4.0
  Top 0.15: OK5.8 45.43,25.72 44.83,26.32 44.83,34.52 44.1,35.25 44.1,40.62 47.25,43.77 X5.10
OC4.1
  Top 0.15: OK5.6 47.97,24.33 47.25,25.05 46.65,25.05 45.15,26.55 45.15,34.65 44.4,35.4 44.4,40.5 45.9,42 48.1,42 X5.9
OC4.2
  Top 0.15: OK5.4 50.51,24.19 49.8,24.9 48.6,24.9 47.85,25.65 47.85,32.4 44.7,35.55 44.7,40.35 46.05,41.7 51.3,41.7 X5.8
OC4.3
  Top 0.15: OK5.2 53.05,24.05 51.9,25.2 48.75,25.2 48.15,25.8 48.15,32.55 45,35.7 45,40.2 46.2,41.4 54.5,41.4 X5.7
OC4.C
  Top 0.4: JP7.3 49.34,32.02 45.45,35.9 45.45,39.95 46.45,40.95 57.55,40.95 X5.6
OC5.0
  Top 0.15: X6.10 X6A.10 48.65,36.55 50.1,35.1 52.05,35.1 55.91,31.25 OK6.8
OC5.1
  Top 0.15: X6.9 X6A.9 51.05,36.55 58.45,29.16 OK6.6
OC5.2
  Top 0.15: OK6.4 60.98,22.29 61.33,22.62 61.33,30.62 55.4,36.55 X6A.8 X6.8
OC5.3
  Top 0.15: X6.7 X6A.7 57.75,34.7 62.6,29.85 62.9,29.85 63.52,29.23 OK6.2
OC5.C  (via drill 0.3 pad 0.6)
  Top 0.4: JP8.3 60.83,24.93 60.83,30.32 56.65,34.5 v56.4,34.5
  Bottom 0.4: v56.4,34.5 58.92,34.5 61.25,36.52 X6A.6 X6.6
OC6.0
  Top 0.15: OK7.8 66.36,28.89 64.95,30.3 64.5,30.3 59.25,35.55 59.25,40.2 62.25,43.2 63.3,43.2 X5.5
OC6.1
  Top 0.15: OK7.6 68.89,24.55 68.4,25.05 67.35,25.05 66.7,25.7 66.7,29 65.1,30.6 64.65,30.6 59.55,35.7 59.55,40.05 62.4,42.9 66.5,42.9 X5.4
OC6.2
  Top 0.15: OK7.4 71.44,24.27 70.8,24.9 69.9,24.9 68.85,25.95 68.85,29.4 67.35,30.9 64.8,30.9 59.85,35.85 59.85,39.9 62.55,42.6 69.7,42.6 X5.3
OC6.3
  Top 0.15: OK7.2 73.97,24.27 73.05,25.2 70.05,25.2 69.28,25.98 69.28,29.43 67.5,31.2 67.05,31.2 62.7,35.55 62.7,40.2 64.8,42.3 72.9,42.3 X5.2
OC6.C
  Top 0.4: JP9.3 70.21,29.11 67.67,31.65 67.3,31.65 63.15,35.8 63.15,40.02 64.97,41.85 75.95,41.85 X5.1
OC7.0
  Top 0.15: OK8.8 76.86,33.24 76.2,33.9 70.42,33.9 69.28,35.05 65.95,35.05 X6A.5 X6.5
OC7.1
  Top 0.15: OK8.6 79.39,22.3 79.25,22.45 79.25,31.3 76.35,34.2 70.6,34.2 X6A.4 X6.4
OC7.2
  Top 0.15: OK8.4 81.94,22.23 82.2,22.5 82.2,29.7 76.8,35.1 73.2,35.1 X6A.3 X6.3
OC7.3
  Top 0.15: OK8.2 84.47,29.07 83.55,30 82.35,30 75.8,36.55 X6A.2 X6.2
OC7.C
  Top 0.4: JP10.3 81.75,24.89 81.75,29.48 76.58,34.65 70.95,34.65 70.05,35.55 70.05,39.9 71.1,40.95 77.03,40.95 X6.1 X6A.1
VC+  (via drill 0.3 pad 0.6)
  Top 0.4: C2.2 v86.03,25.95
  Bottom 0.4: JP3.5 6.08,27.62 8.6,27.62 9.88,26.35 JP3.2 11.18,25.07 14.05,25.07 JP4.1 16.59,25.07 19.12,25.07 JP4.6 21.7,27.65 24.57,27.65 25.8,28.88 JP5.5 | JP5.5 | JP5.5 27.07,27.62 29.62,27.62 30.88,26.38 JP5.2 32.16,25.07 35,25.07 JP6.1 37.55,25.07 40.1,25.07 41.35,26.32 JP6.6 | JP6.6 | JP6.6 42.64,27.62 45.52,27.62 46.77,28.88 46.78,28.88 JP7.5 48.06,27.62 50.6,27.62 JP7.2 53.17,25.05 55.92,25.05 57.15,23.82 JP8.1 58.43,25.07 60.95,25.07 62.23,26.35 JP8.6 63.55,27.65 66.42,27.65 JP9.5 68.94,27.62 71.47,27.62 JP9.2 73.91,25.2 76.65,25.2 78.05,23.8 JP10.1 78.15,23.83 78.15,23.85 79.35,25.05 81.91,25.05 JP10.6 83.64,26.77 F1.1 | F1A.1 87.44,26.77 F1.1 | F1.1 86.03,26.77 v86.03,25.95
VC-  (via drill 0.3 pad 0.6)
  Top 0.4: JP2.2 86.7,3.31 86.7,17.85 v84.9,19.65 | v23.85,30.3 24.07,30.07 24.07,26.57 v23.85,26.35 | v45.75,30.3 45.75,27.4 JP7.6 | C2.1 86.02,23.27 86.03,23.27 v86.03,23.95
  Bottom 0.4: JP10.2 75.3,26.35 JP9.1 72.75,30.3 51.88,30.3 | 62.25,22.35 JP8.5 64.78,26.36 JP9.6 | 62.25,22.35 83.2,22.35 | 83.2,22.35 JP10.5 85.88,23.8 v86.03,23.95 | 41.4,22.35 41.35,22.35 JP6.5 43.9,26.35 JP7.6 | 41.4,22.35 62.25,22.35 | 20.4,23.82 JP4.5 | JP5.6 v23.85,26.35 v23.84,26.36 22.93,26.36 20.4,23.82 | JP8.2 54.41,26.35 JP7.1 51.88,30.3 | JP6.2 36.27,26.32 33.45,26.32 JP5.1 30.88,30.3 | JP4.2 12.44,26.35 JP3.1 9.9,30.3 | 9.9,30.3 v23.85,30.3 30.88,30.3 | 30.88,30.3 v45.75,30.3 51.88,30.3 | 9.9,30.3 4.35,30.3 3.6,29.55 3.6,27.6 4.8,26.4 4.8,26.37 JP3.6 | 41.4,22.35 20.4,22.35 20.4,23.82 | 83.2,22.35 83.2,21.35 v84.9,19.65
VIN
  Top 0.4: JP1.1 72.72,2.05 69.06,2.05 X1.49
VSUPP
  Bottom 0.4: JP1.2 76.69,3.45 86.1,3.45 86.7,4.05 86.7,5.85 88.5,7.66 88.53,21.85 88.06,22.31 F1A.2 88.04,22.32 F1.2

### Text on the board
Top: sautter.com